# Altium project CurrentSourceModule.PrjPcb
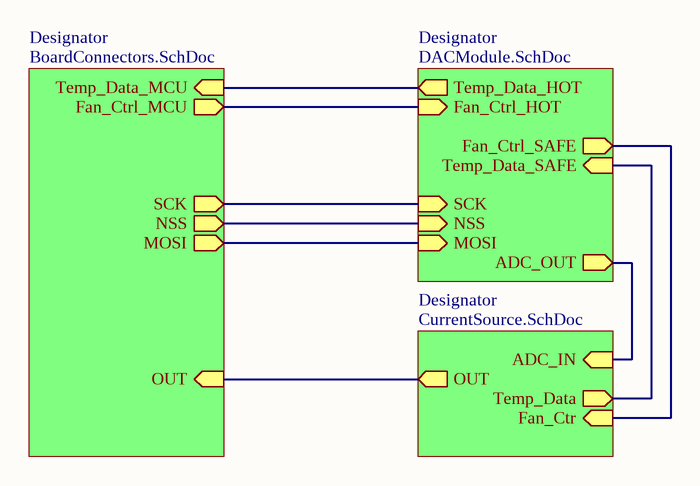
[diagram p0: Main.SchDoc]
4 sheets, 64 parts. Net scope: hierarchical (ports join the sheet entries above them; power ports are global).
Board file: CurrentSource.PcbDoc
Sheets:
  Main.SchDoc
    Designator = BoardConnectors.SchDoc
    Designator = DACModule.SchDoc
    Designator = CurrentSource.SchDoc

## Sheet Main.SchDoc
size A4; Date: 07.06.2021; Author: Mateusz Mróz; CompanyName: AGH; SheetNumber: 1; SheetTotal: 4

### Sub-sheets
Designator = BoardConnectors.SchDoc: SCK (out), NSS (out), MOSI (out), OUT (in), Temp_Data_MCU (in), Fan_Ctrl_MCU (out)
Designator = DACModule.SchDoc: NSS (in), MOSI (in), SCK (in), ADC_OUT (out), Fan_Ctrl_HOT (in), Temp_Data_SAFE (in), Fan_Ctrl_SAFE (out), Temp_Data_HOT (out)
Designator = CurrentSource.SchDoc: ADC_IN (in), OUT (out), Fan_Ctr (in), Temp_Data (out)

### Nets
NetC2_1: sheet Designator/ADC_OUT, sheet Designator/ADC_IN
NetCON1_13: sheet Designator/Temp_Data_MCU, sheet Designator/Temp_Data_HOT
NetCON1_14: sheet Designator/Fan_Ctrl_MCU, sheet Designator/Fan_Ctrl_HOT
NetCON2_3: sheet Designator/OUT, sheet Designator/OUT
NetCON3_10: sheet Designator/NSS, sheet Designator/NSS
NetCON3_11: sheet Designator/SCK, sheet Designator/SCK
NetCON3_13: sheet Designator/MOSI, sheet Designator/MOSI
NetQ1_3: sheet Designator/Temp_Data_SAFE, sheet Designator/Temp_Data
NetR18_2: sheet Designator/Fan_Ctrl_SAFE, sheet Designator/Fan_Ctr

### Notes on the sheet
- University name:
- Degree course:
- 3th year electronics
- Date:
- Author:
- Student Index:
- Course:
- Checked by:
- PUE
- dr hab. inż. Cezary Worek, prof. AGH
- 305093
- Project name:
- Document name:
- Variant name:
- Sheet/all:
- /
- Version number:

## Sheet BoardConnectors.SchDoc
size A4; Date: 07.06.2021; Author: Mateusz Mróz; CompanyName: AGH; SheetNumber: 3; SheetTotal: 4
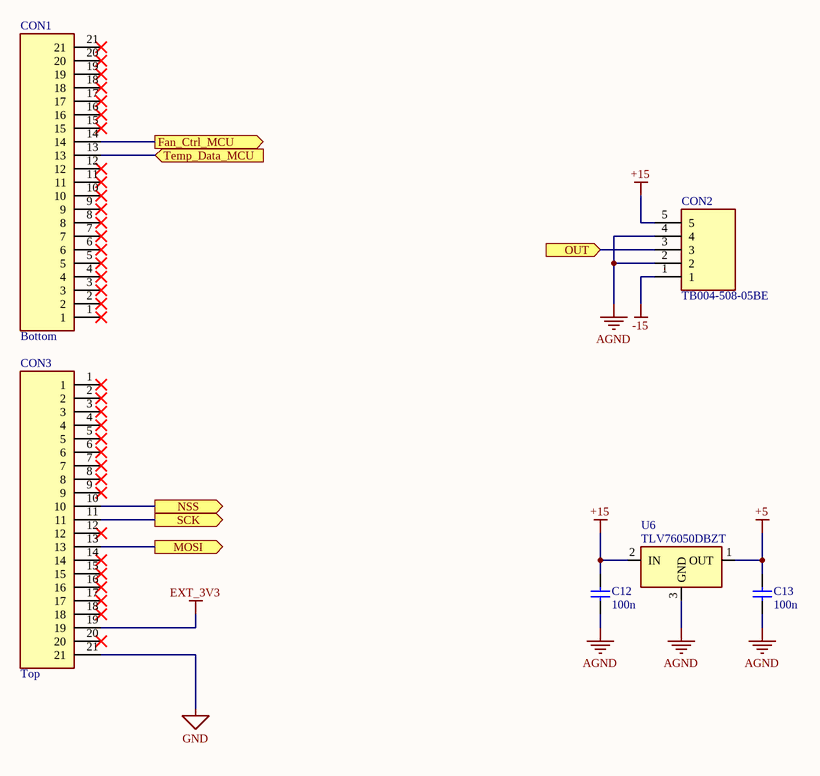
[diagram p1: BoardConnectors.SchDoc]

### Parts
C12  100n  [Cap_0603_MD_outline]
C13  100n  [Cap_0603_MD_outline]
CON1  Location: Bottom  [SOCKET_1X21_2.54]  (hidden comment: Socket 21)
CON2  TB004-508-05BE  [TB00450805BE]
CON3  Location: Top  [SOCKET_1X21_2.54]  (hidden comment: Socket 21)
U6  TLV76050DBZT  [SOT95P237X112-3N]

### Ports
Fan_Ctrl_MCU (out), MOSI (out), NSS (out), OUT (in), SCK (out), Temp_Data_MCU (in)

### Nets
+5: C13.2 U6.1(OUT)
+15: C12.2 CON2.5 U6.2(IN)
-15: CON2.1
AGND: C12.1 C13.1 CON2.2 CON2.4 U6.3(GND)
EXT_3V3: CON3.19
GND: CON3.21
NetCON1_13: CON1.13 ; port Temp_Data_MCU
NetCON1_14: CON1.14 ; port Fan_Ctrl_MCU
NetCON2_3: CON2.3 ; port OUT
NetCON3_10: CON3.10 ; port NSS
NetCON3_11: CON3.11 ; port SCK
NetCON3_13: CON3.13 ; port MOSI

Not connected (* = marked no-connect by the designer): CON1 1* 2* 3* 4* 5* 6* 7* 8* 9* 10* 11* 12* 15* 16* 17* 18* 19* 20* 21*; CON3 1* 2* 3* 4* 5* 6* 7* 8* 9* 12* 14* 15* 16* 17* 18* 20*

### Notes on the sheet
- University name:
- Degree course:
- 3th year electronics
- Date:
- Author:
- Student Index:
- Course:
- Checked by:
- PUE
- dr hab. inż. Cezary Worek, prof. AGH
- 305093
- Project name:
- Document name:
- Variant name:
- Sheet/all:
- /
- Version number:

### Library data of the parts
C12 C13 = Capacitor: MPN: GRM188R72A104KA35; Value: 100n; Package: 0603
CON1 CON3 = Socket 21: Socket, 21-Pin; System: Connector; MPN: *
CON2 = TB004-508-05BE: Terminal Block Screw; MPN: TB004-508-05BE
U6 = TLV76050DBZT: Voltage Regulator 5V; MPN: TLV76050DBZT

## Sheet DACModule.SchDoc
size A4; Date: 07.06.2021; Author: Mateusz Mróz; CompanyName: AGH; SheetNumber: 5; SheetTotal: 5
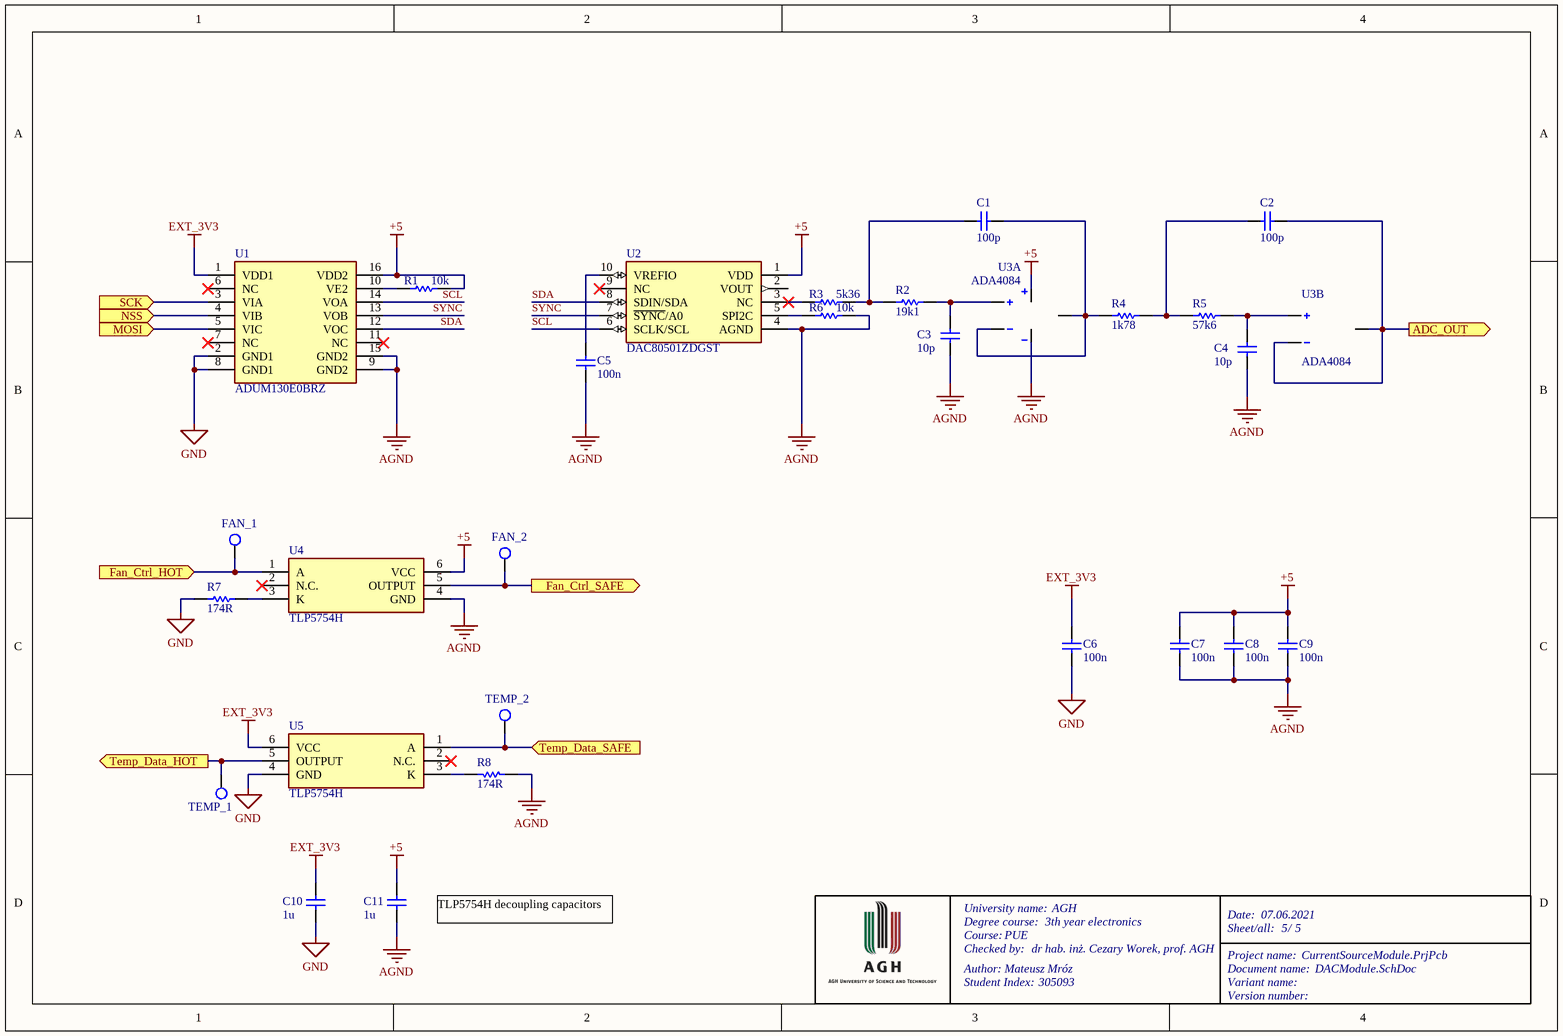
[diagram p2: DACModule.SchDoc]

### Parts
C1  100p  [Cap_0603_MD_outline]
C2  100p  [Cap_0603_MD_outline]
C3  10p  [Cap_0603_MD_outline]
C4  10p  [Cap_0603_MD_outline]
C5  100n  [Cap_0603_MD_outline]
C6  100n  [Cap_0603_MD_outline]
C7  100n  [Cap_0603_MD_outline]
C8  100n  [Cap_0603_MD_outline]
C9  100n  [Cap_0603_MD_outline]
C10  1u  [Cap_0805_MD_outline]
C11  1u  [Cap_0805_MD_outline]
R1  10k  [Res_0603_MD_outline]
R2  19k1  [Res_0603_MD_outline]
R3  5k36  [Res_0603_MD_outline]
R4  1k78  [Res_0603_MD_outline]
R5  57k6  [Res_0603_MD_outline]
R6  10k  [Res_0603_MD_outline]
R7  174R  [Res_0603_MD_outline]
R8  174R  [Res_0603_MD_outline]
TP1  FAN_1  [TP_SQ40]  (no BOM)
TP2  FAN_2  [TP_SQ40]  (no BOM)
TP3  TEMP_1  [TP_SQ40]  (no BOM)
TP4  TEMP_2  [TP_SQ40]  (no BOM)
U1  ADUM130E0BRZ  [SOIC127P600X175-16N]
U2  DAC80501ZDGST  [SOP50P490X110-10N]
U3  ADA4084  [SON50P300X300X85-9N-D]  (parts A,B,C of 3)
U4  TLP5754H  [SOIC127P1000X230-6N]
U5  TLP5754H  [SOIC127P1000X230-6N]

### Ports
ADC_OUT (out), Fan_Ctrl_HOT (in), Fan_Ctrl_SAFE (out), MOSI (in), NSS (in), SCK (in), Temp_Data_HOT (out), Temp_Data_SAFE (in)

### Nets
+5: C7.2 C8.2 C9.2 C11.2 R1.1 U1.16(VDD2) U2.1(VDD) U3.8(V+) U4.6(VCC)
AGND: C3.1 C4.1 C5.1 C7.1 C8.1 C9.1 C11.1 R6.1 R8.1 U1.9(GND2) U1.15(GND2) U2.4(AGND) U3.4(V-) U4.4(GND)
EXT_3V3: C6.2 C10.2 U1.1(VDD1) U5.6(VCC)
GND: C6.1 C10.1 R7.1 U1.2(GND1) U1.8(GND1) U5.4(GND)
SCL: U1.14(VOA) U2.6(SCLK/SCL)
SDA: U1.12(VOC) U2.8(SDIN/SDA)
SYNC: U1.13(VOB) U2.7(~{SYNC}/A0)
NetC1_1: C1.1 R4.1 U3.1(OUT_A) U3.2(-IN_A)
NetC1_2: C1.2 R2.1 R3.1
NetC2_1: C2.1 U3.6(-IN_B) U3.7(OUT_B) ; port ADC_OUT
NetC2_2: C2.2 R4.2 R5.1
NetC3_2: C3.2 R2.2 U3.3(+IN_A)
NetC4_2: C4.2 R5.2 U3.5(+IN_B)
NetC5_2: C5.2 U2.10(VREFIO)
NetCON1_13: TP3.1 U5.5(OUTPUT) ; port Temp_Data_HOT
NetCON1_14: TP1.1 U4.1(A) ; port Fan_Ctrl_HOT
NetCON3_10: U1.4(VIB) ; port NSS
NetCON3_11: U1.3(VIA) ; port SCK
NetCON3_13: U1.5(VIC) ; port MOSI
NetQ1_3: TP4.1 U5.1(A) ; port Temp_Data_SAFE
NetR1_2: R1.2 U1.10(VE2)
NetR3_2: R3.2 U2.3(NC)
NetR6_2: R6.2 U2.5(SPI2C)
NetR7_2: R7.2 U4.3(K)
NetR8_2: R8.2 U5.3(K)
NetR18_2: TP2.1 U4.5(OUTPUT) ; port Fan_Ctrl_SAFE

Not connected (* = marked no-connect by the designer): U1 6(NC)* 7(NC)* 11(NC)*; U2 2(VOUT) 9(NC)*; U4 2(N.C.)*; U5 2(N.C.)*

### Notes on the sheet
- (near C11) TLP5754H decoupling capacitors
- University name:
- Degree course:
- 3th year electronics
- Date:
- Author:
- Student Index:
- Course:
- Checked by:
- PUE
- dr hab. inż. Cezary Worek, prof. AGH
- 305093
- Project name:
- Document name:
- Variant name:
- Sheet/all:
- /
- Version number:

### Library data of the parts
C1 C2 = Capacitor: MPN: GQM1875C2E101JB12D; Value: 100p; Package: 0603
C3 C4 = Capacitor: MPN: GRM1885C2E100JW07D; Value: 10p; Package: 0603
C5-C9 = Capacitor: MPN: GRM188R72A104KA35; Value: 100n; Package: 0603
C10 C11 = Capacitor: MPN: GRM219R7YA105KA12; Value: 1u; Package: 0805
R1 R6 = Resistor: MPN: CRCW060310K0FKEAC; Value: 10k; Package: 0603
R2 = Resistor: MPN: CRCW060319K1FKTA; Value: 19k1; Package: 0603
R3 = Resistor: MPN: CRCW06035K36FKEA; Value: 5k36; Package: 0603
R4 = Resistor: MPN: CRCW06031K78FKTA; Value: 1k78; Package: 0603
R5 = Resistor: MPN: CRCW060357K6FKEA; Value: 57k6; Package: 0603
R7 R8 = Resistor: MPN: CRCW0603174RFKEA; Value: 174R; Package: 0603
TP1-TP4 = TestPoint: Test point; HelpURL: *; MPN: *
  TP1: Value: FAN_1
  TP2: Value: FAN_2
  TP3: Value: TEMP_1
  TP4: Value: TEMP_2
U1 = ADUM130E0BRZ: Digital isolator; MPN: ADUM130E0BRZ
U2 = DAC80501ZDGST: DAC; Resolution: 16bit; MPN: DAC80501ZDGST
U3 = ADA4084-2ACPZ-R7: Op Amp; MPN: ADA4084-2ACPZ-R7
U4 U5 = TLP5754H: Optocoupler; MPN: TLP5754H(TP4,E

## Sheet CurrentSource.SchDoc
size A4; Date: 07.06.2021; Author: Mateusz Mróz; CompanyName: AGH; SheetNumber: 4; SheetTotal: 5
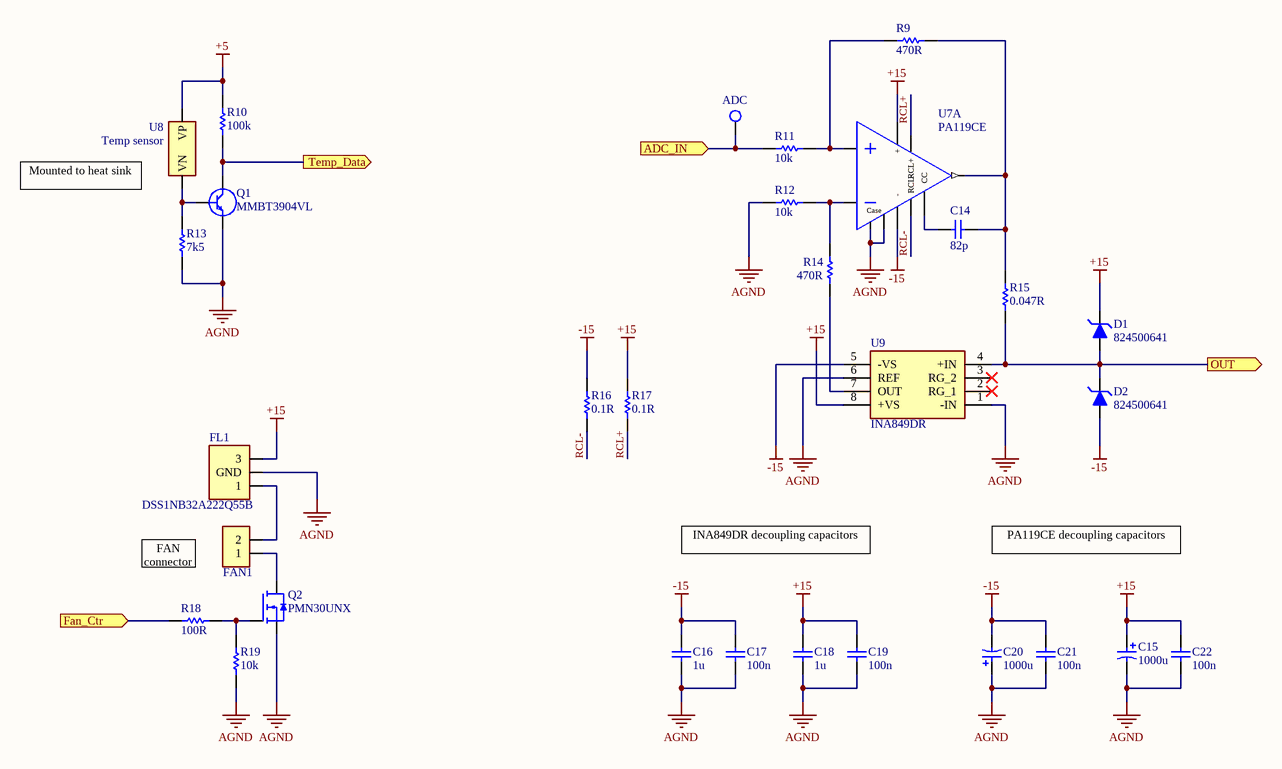
[diagram p3: CurrentSource.SchDoc]

### Parts
C14  82p  [Cap_0603_MD_outline]
C15  1000u  [CAPAE1350X1400N]
C16  1u  [Cap_0805_MD_outline]
C17  100n  [Cap_0603_MD_outline]
C18  1u  [Cap_0805_MD_outline]
C19  100n  [Cap_0603_MD_outline]
C20  1000u  [CAPAE1350X1400N]
C21  100n  [Cap_0603_MD_outline]
C22  100n  [Cap_0603_MD_outline]
D1  824500641  [DIOM5127X250N]
D2  824500641  [DIOM5127X250N]
FAN1  (no value)  [Pads_2]  (no BOM)
FL1  DSS1NB32A222Q55B  [DSS1NB32A223Q91A]
Q1  MMBT3904VL  [SOT95P230X110-3N]
Q2  PMN30UNX  [SOT95P275X110-6N]
R9  470R  [Res_0603_MD_outline]
R10  100k  [Res_0603_MD_outline]
R11  10k  [Res_0603_MD_outline]
R12  10k  [Res_0603_MD_outline]
R13  7k5  [Res_0603_MD_outline]
R14  470R  [Res_0603_MD_outline]
R15  0.047R  [Res_2512]
R16  0.1R  [Res_0603_MD_outline]
R17  0.1R  [Res_0603_MD_outline]
R18  100R  [Res_0603_MD_outline]
R19  10k  [Res_0603_MD_outline]
TP8  ADC  [TP_SQ40]  (no BOM)
U7  PA119CE  [PA119CE]  (parts A,B,C of 3)
U8  Temp sensor  [TO-92S]
U9  INA849DR  [SOIC127P600X175-8N]

### Ports
ADC_IN (in), Fan_Ctr (in), OUT (out), Temp_Data (out)

### Nets
+5: R10.2 U8.2(VP)
+15: C15.1 C18.2 C19.2 C22.2 D1.1(K) FL1.3 R17.2 U7.3(+) U9.8(+VS)
-15: C16.2 C17.2 C20.2 C21.2 D2.2(A) R16.2 U7.6(-) U9.5(-VS)
AGND: C15.2 C16.1 C17.1 C18.1 C19.1 C20.1 C21.1 C22.1 FL1.2(GND) Q1.2(E) Q2.4(S) R12.1 R13.1 R19.1 U7.MH1 U7.MH2 U9.1(-IN) U9.6(REF)
RCL+: R17.1 U7.2(RCL+)
RCL-: R16.1 U7.7(RCL-)
NetC2_1: R11.1 TP8.1 ; port ADC_IN
NetC14_1: C14.1 R9.2 R15.2 U7.1(OUT)
NetC14_2: C14.2 U7.8(CC)
NetCON2_3: D1.2(A) D2.1(K) R15.1 U9.4(+IN) ; port OUT
NetFAN1_1: FAN1.1 Q2.1(D)
NetFAN1_2: FAN1.2 FL1.1
NetQ1_1: Q1.1(B) R13.2 U8.1(VN)
NetQ1_3: Q1.3(C) R10.1 ; port Temp_Data
NetQ2_3: Q2.3(G) R18.1 R19.2
NetR9_1: R9.1 R11.2 U7.4(+IN)
NetR12_2: R12.2 R14.2 U7.5(-IN)
NetR14_1: R14.1 U9.7(OUT)
NetR18_2: R18.2 ; port Fan_Ctr

Not connected (* = marked no-connect by the designer): U9 2(RG_1)* 3(RG_2)*

### Notes on the sheet
- Mounted to heat sink
- INA849DR decoupling capacitors
- PA119CE decoupling capacitors
- FAN
  connector
- University name:
- Degree course:
- 3th year electronics
- Date:
- Author:
- Student Index:
- Course:
- Checked by:
- PUE
- dr hab. inż. Cezary Worek, prof. AGH
- 305093
- Project name:
- Document name:
- Variant name:
- Sheet/all:
- /
- Version number:
- (in symbol PA119CE, part C) Case

### Library data of the parts
C14 = Capacitor: MPN: GQM1875C2E820JB12D; Value: 82p; Package: 0603
C15 C20 = Capacitor Electrolytic: Aluminium Electrolytic Capacitor; MPN: EEE-FK1E102AQ; Value: 1000u
C16 C18 = Capacitor: MPN: GCJ21BR71H105KA01L; Value: 1u; Package: 0803
C17 C19 C21 C22 = Capacitor: MPN: GRM188R72A104KA35; Value: 100n; Package: 0603
D1 D2 = 824500641: TVS Diode; MPN: 824500641
FAN1 = Pads_2: 2 Pads
FL1 = DSS1NB32A222Q55B: EMIFilter; MPN: DSS1NB32A222Q55B
Q1 = MMBT3904VL: Transistor BJT NPN; MPN: MMBT3904VL
Q2 = PMN30UNX: Transistor MOSFET N-Channel; MPN: PMN30UNX
R9 R14 = Resistor: MPN: MCT0603MD4700BP100; Value: 470R; Package: 0603
R10 = Resistor: MPN: CRCW0603100KFKEAC; Value: 100k; Package: 0603
R11 R12 = Resistor: MPN: MCT06030E1002BP100; Value: 10k; Package: 0603
R13 = Resistor: MPN: CRCW06037K50FKEA; Value: 7k5; Package: 0603
R15 = Shunt: Resistor; MPN: GMR100HTBFQR047; Value: 0.047R; Package: 2512
R16 R17 = Resistor: MPN: RCWE0603R100FNEA; Value: 0.1R; Package: 0603
R18 = Resistor: MPN: CRCW0603100RFKEAHP; Value: 100R; Package: 0603
R19 = Resistor: MPN: CRCW060310K0FKEAC; Value: 10k; Package: 0603
TP8 = TestPoint: Test point; Value: ADC; HelpURL: *; MPN: *
U7 = PA119CE: Op Amp; MPN: PA119CE
U8 = LMT01LPGM: Temperature sensor, Pulse Train Interface; MPN: LMT01LPGM
U9 = INA849DR: Instrumental Amplifier; MPN: INA849DR

## Nets that join several sheets
+5: BoardConnectors (C13.2 U6.1), DACModule (9 pins), CurrentSource (R10.2 U8.2)
+15: BoardConnectors (C12.2 CON2.5 U6.2), CurrentSource (9 pins)
-15: BoardConnectors (CON2.1), CurrentSource (8 pins)
AGND: BoardConnectors (5 pins), DACModule (14 pins), CurrentSource (18 pins)
EXT_3V3: BoardConnectors (CON3.19), DACModule (C6.2 C10.2 U1.1 U5.6)
GND: BoardConnectors (CON3.21), DACModule (6 pins)
NetC2_1: DACModule (C2.1 U3.6 U3.7), CurrentSource (R11.1 TP8.1)
NetCON1_13: BoardConnectors (CON1.13), DACModule (TP3.1 U5.5)
NetCON1_14: BoardConnectors (CON1.14), DACModule (TP1.1 U4.1)
NetCON2_3: BoardConnectors (CON2.3), CurrentSource (D1.2 D2.1 R15.1 U9.4)
NetCON3_10: BoardConnectors (CON3.10), DACModule (U1.4)
NetCON3_11: BoardConnectors (CON3.11), DACModule (U1.3)
NetCON3_13: BoardConnectors (CON3.13), DACModule (U1.5)
NetQ1_3: DACModule (TP4.1 U5.1), CurrentSource (Q1.3 R10.1)
NetR18_2: DACModule (TP2.1 U4.5), CurrentSource (R18.2)